# Altium schematic sheet 4_STM32_Peripheral.SchDoc
size A; SheetNumber: 4; SheetTotal: 4
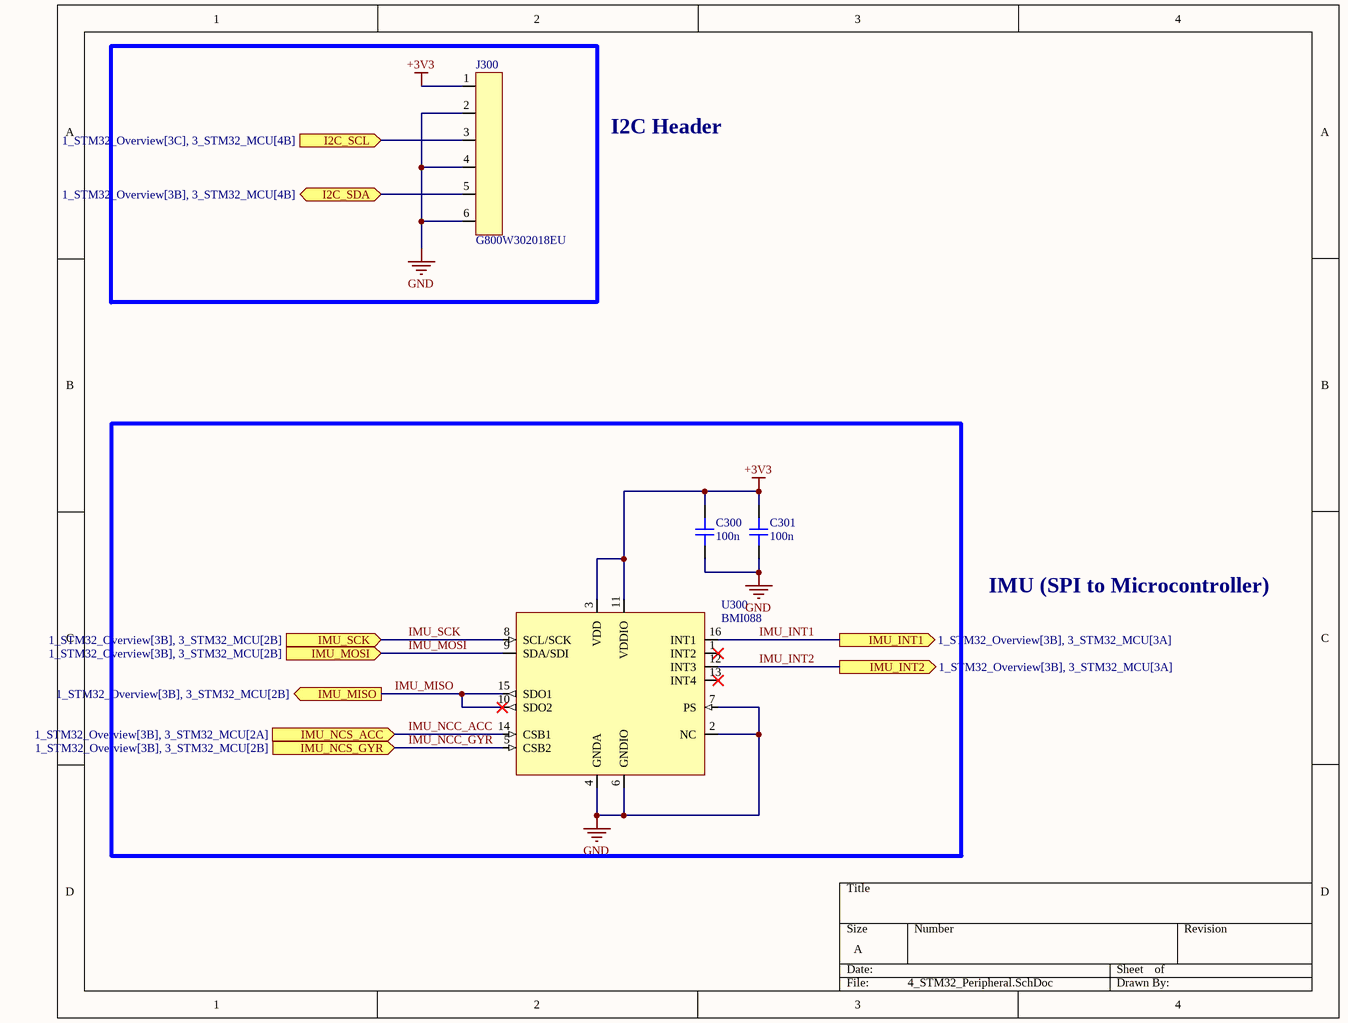
[diagram p0: 4_STM32_Peripheral.SchDoc]

## Parts
C300  100n  [CAP_0603]
C301  100n  [CAP_0603]
J300  G800W302018EU  [G800W302018EU]
U300  BMI088  [BMI088]

## Ports
I2C_SCL (in, see 1_STM32_Overview[3C], 3_STM32_MCU[4B]), I2C_SDA (bidir, see 1_STM32_Overview[3B], 3_STM32_MCU[4B]), IMU_INT1 (out, see 1_STM32_Overview[3B], 3_STM32_MCU[3A]), IMU_INT2 (out, see 1_STM32_Overview[3B], 3_STM32_MCU[3A]), IMU_MISO (out, see 1_STM32_Overview[3B], 3_STM32_MCU[2B]), IMU_MOSI (in, see 1_STM32_Overview[3B], 3_STM32_MCU[2B]), IMU_NCS_ACC (in, see 1_STM32_Overview[3B], 3_STM32_MCU[2A]), IMU_NCS_GYR (in, see 1_STM32_Overview[3B], 3_STM32_MCU[2B]), IMU_SCK (in, see 1_STM32_Overview[3B], 3_STM32_MCU[2B])

## Nets
+3V3: C300.2 C301.2 J300.1 U300.3(VDD) U300.11(VDDIO)
GND: C300.1 C301.1 J300.2 J300.4 J300.6 U300.2(NC) U300.4(GNDA) U300.6(GNDIO) U300.7(PS)
I2C_SCL: J300.3 ; port I2C_SCL
I2C_SDA: J300.5 ; port I2C_SDA
IMU_INT1: U300.16(INT1) ; port IMU_INT1
IMU_INT2: U300.12(INT3) ; port IMU_INT2
IMU_MISO: U300.10(SDO2) U300.15(SDO1) ; port IMU_MISO
IMU_MOSI: U300.9(SDA/SDI) ; port IMU_MOSI
IMU_NCC_ACC: U300.14(CSB1) ; port IMU_NCS_ACC
IMU_NCC_GYR: U300.5(CSB2) ; port IMU_NCS_GYR
IMU_SCK: U300.8(SCL/SCK) ; port IMU_SCK

Not connected (* = marked no-connect by the designer): U300 1(INT2)* 13(INT4)*

## Notes on the sheet
- I2C Header
- IMU (SPI to Microcontroller)

## Library data of the parts
C300 C301 = CMP-001-00087-1: Capacitor SMD 0603; Manufacturer Part Number: *; Distributor Link: *; Manufacturer: *; Rating: *; Design Item ID: CAP_0603; Source: Schematic-Lib-PhilsLab.SchLib; Dielectric: *; LCSC: *
J300 = CMP-002-00116-1: Pin Header 6 Position 2.54mm Pitch; Manufacturer: Amphenol; Design Item ID: G800W302018EU; Manufacturer Part Number: G800W302018EU; Source: Schematic-Lib-PhilsLab.SchLib
U300 = CMP-028-000011-1: Inertial Measurement Unit IMU 6-Axis LGA; Manufacturer: Bosch; Manufacturer Part Number: BMI088; Source: Schematic-Lib-PhilsLab.SchLib; Design Item ID: BMI088